# EAGLE design powersupply (EAGLE 7.5.0)
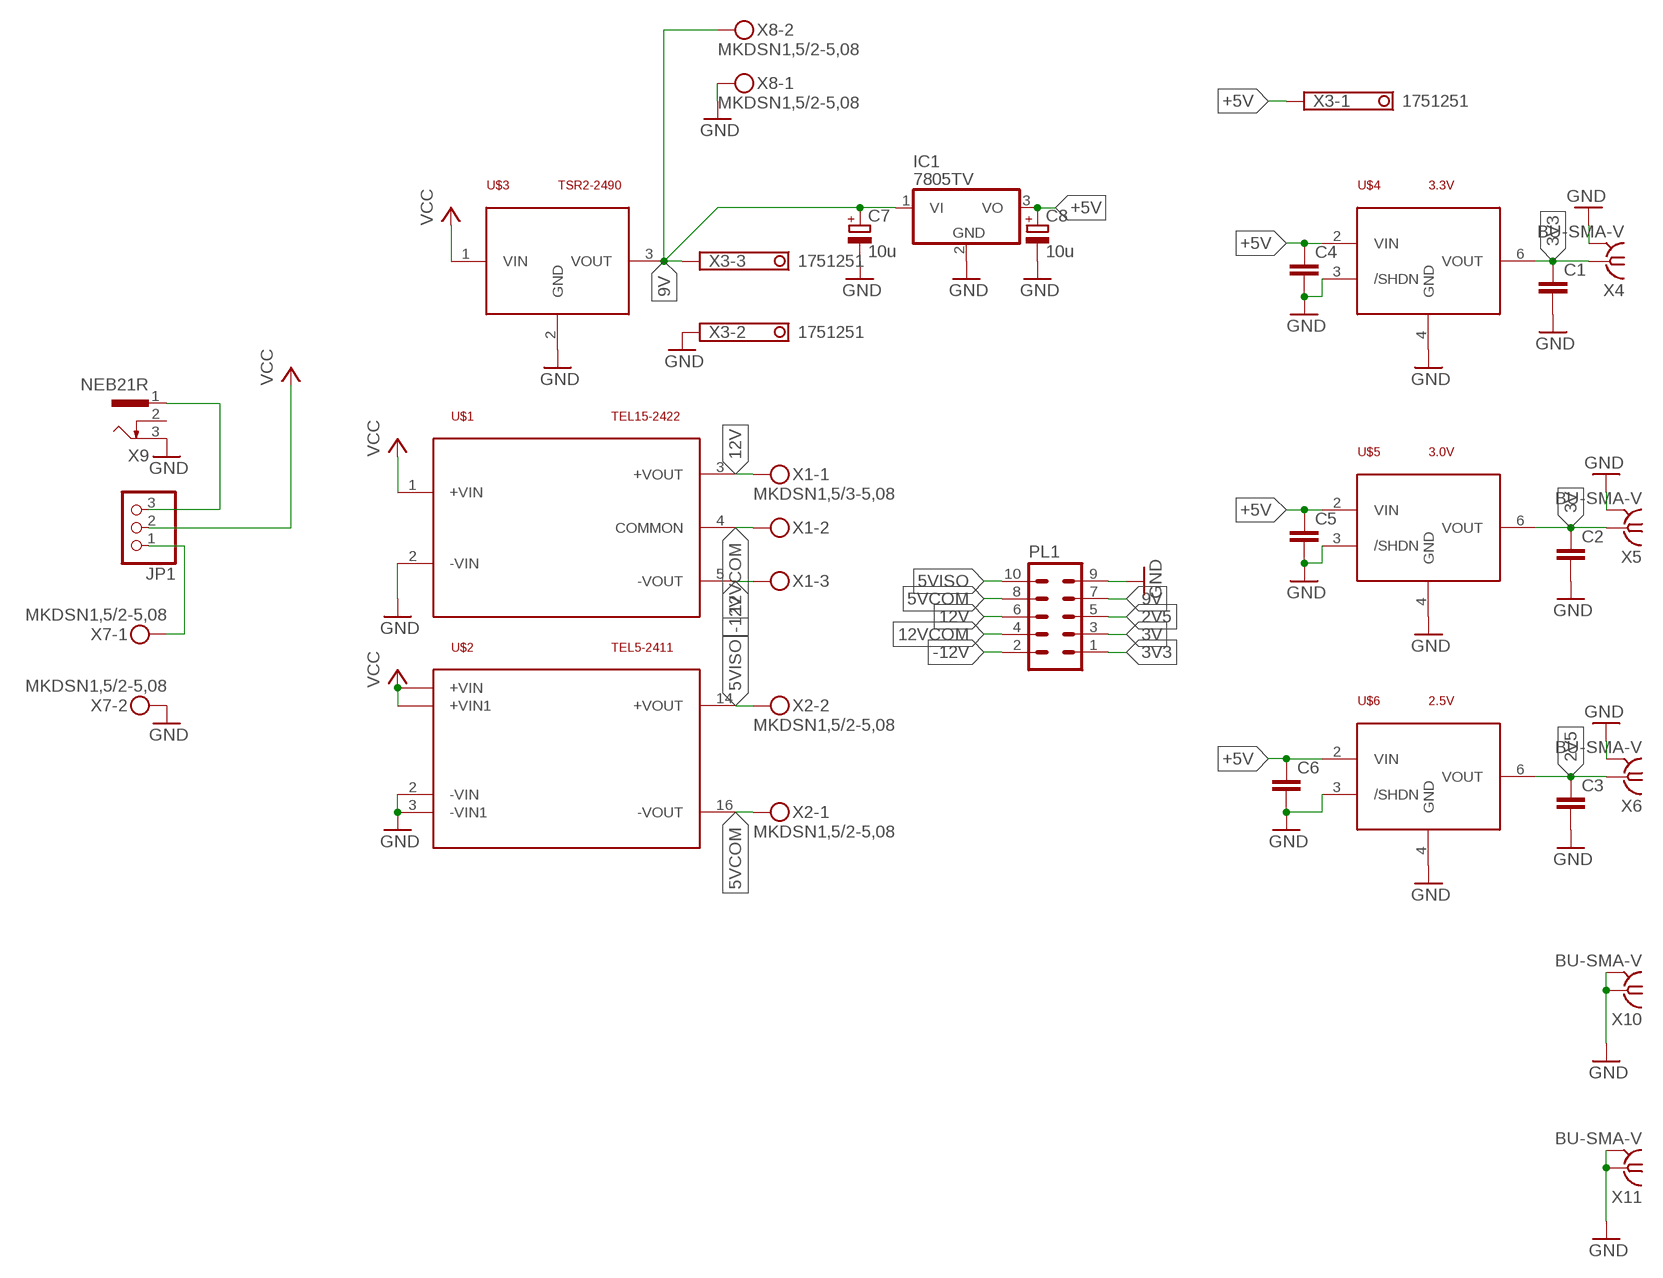
[diagram p0: schematic, sheet 1]

## Parts
C1  C-EUC0805  [C0805]
C2  C-EUC0805  [C0805]
C3  C-EUC0805  [C0805]
C4  C-EUC0805  [C0805]
C5  C-EUC0805  [C0805]
C6  C-EUC0805  [C0805]
C7  10u  CPOL-EUB  [PANASONIC_B]
C8  10u  CPOL-EUB  [PANASONIC_B]
IC1  7805TV  [TO220V]
JP1  PINHD-1X3  [1X03]
PL1  10V  [10V]
U$1  TEL15-2422  TEL-15  [TEL-15]
U$2  TEL5-2411  TEL-5-SINGLE  [TEL-5-SINGLE]
U$3  TSR2-2490  TSR2  [TSR2]
U$4  3.3V  LT1461  [SO8]
U$5  3.0V  LT1461  [SO8]
U$6  2.5V  LT1461  [SO8]
X1  MKDSN1,5/3-5,08  [MKDSN1,5/3-5,08]
X2  MKDSN1,5/2-5,08  [MKDSN1,5/2-5,08]
X3  1751251  [1751251]
X4  BU-SMA-V  [BU-SMA-V]
X5  BU-SMA-V  [BU-SMA-V]
X6  BU-SMA-V  [BU-SMA-V]
X7  MKDSN1,5/2-5,08  [MKDSN1,5/2-5,08]
X8  MKDSN1,5/2-5,08  [MKDSN1,5/2-5,08]
X9  NEB21R  [NEB21R]
X10  BU-SMA-V  [BU-SMA-V]
X11  BU-SMA-V  [BU-SMA-V]

## Nets
2V5: C3.1 PL1.5 U$6.6(VOUT) X6.1
3V: C2.1 PL1.3 U$5.6(VOUT) X5.1
3V3: C1.1 PL1.1 U$4.6(VOUT) X4.1
5VCOM: PL1.8 U$2.16(-VOUT) X2.1
5VISO: PL1.10 U$2.14(+VOUT) X2.2
9V: C7.+ IC1.1(VI) PL1.7 U$3.3(VOUT) X3.3 X8.2
12V: PL1.6 U$1.3(+VOUT) X1.1
12VCOM: PL1.4 U$1.4(COMMON) X1.2
+5V: C4.1 C5.1 C6.1 C8.+ IC1.3(VO) U$4.2(VIN) U$5.2(VIN) U$6.2(VIN) X3.1
-12V: PL1.2 U$1.5(-VOUT) X1.3
GND: C1.2 C2.2 C3.2 C4.2 C5.2 C6.2 C7.- C8.- IC1.2(GND) PL1.9 U$1.2(-VIN) U$2.2(-VIN) U$2.3(-VIN1) U$3.2(GND) U$4.3(/SHDN) U$4.4(GND) U$5.3(/SHDN) U$5.4(GND) U$6.3(/SHDN) U$6.4(GND) X3.2 X4.2 X4.3 X4.4 X4.5 X5.2 X5.3 X5.4 X5.5 X6.2 X6.3 X6.4 X6.5 X7.2 X8.1 X9.3 X10.1 X10.2 X10.3 X10.4 X10.5 X11.1 X11.2 X11.3 X11.4 X11.5
N$11: JP1.1 X7.1
N$12: JP1.3 X9.1
VCC: JP1.2 U$1.1(+VIN) U$2.22(+VIN) U$2.23(+VIN1) U$3.1(VIN)
Unconnected: X9.2

## Library data of the parts
C1-C6 = rcl:C-EU: CAPACITOR, European symbol
C7 C8 = rcl:CPOL-EU: POLARIZED CAPACITOR, European symbol
IC1 = linear:78*: Positive VOLTAGE REGULATOR Source: http://cache.national.com/ds/LM/LM78L05.pdf http://www.fairchildsemi.com/ds/LM/LM7805.pdf
JP1 = pinhead:PINHD-1X3: PIN HEADER
PL1 = con-harting-v:10V: CONNECTOR; OC_FARNELL: unknown; OC_NEWARK: unknown
U$1 = traco:TEL-15
U$2 = traco:TEL-5-SINGLE
U$3 = traco:TSR2
U$4-U$6 = traco:LT1461
X1 = con-phoenix-508:MKDSN1,5/3-5,08: MKDSN 1,5/ 3-5,08 Printklemme Nennstrom: 13,5 A Nennspannung: 250 V Rastermaß: 5,08 mm Polzahl: 3 Anschlussart: Schraubanschluss Montage: Löten Anschlussrichtung Leiter/Platine: 0 ° Artikelnummer: 1729131 Source: http://eshop.phoenixcontact.com .. 1729131.pdf
X2 X7 X8 = con-phoenix-508:MKDSN1,5/2-5,08: MKDSN 1,5/ 2-5,08 Printklemme Nennstrom: 13,5 A Nennspannung: 250 V Rastermaß: 5,08 mm Polzahl: 2 Anschlussart: Schraubanschluss Montage: Löten Anschlussrichtung Leiter/Platine: 0 ° Artikelnummer: 1729128 Source: http://eshop.phoenixcontact.com .. 1729128.pdf
X3 = con-phoenix-350:1751251: MKDS 1/ 3-3,5 Printklemme Nennstrom: 10 A Bemessungsspannung: 160 V Raster: 3,5 mm Polzahl: 3 Montageart: Löten Anschlussart: Schraubanschluss Anschlussrichtung vom Leiter zur Platine: 0° Source: http://eshop.phoenixcontact.com .. 1751251.pdf; OC_FARNELL: unknown; OC_NEWARK: unknown
X4-X6 X10 X11 = con-coax:BU-SMA-V: FEMALE SMA CONNECTOR Radiall distributor RS 112-3794; OC_FARNELL: unknown; OC_NEWARK: unknown
X9 = con-lumberg:NEB21R: Netzgeräte-Einbaukupplung abgewinkelte Ausführung mit Öffner Source: http://www.lumberg.com/Produkte/PDFs/NEB21R.pdf; MPN: NEB 21 R; OC_FARNELL: 1217037; OC_NEWARK: 97K6458

## Board
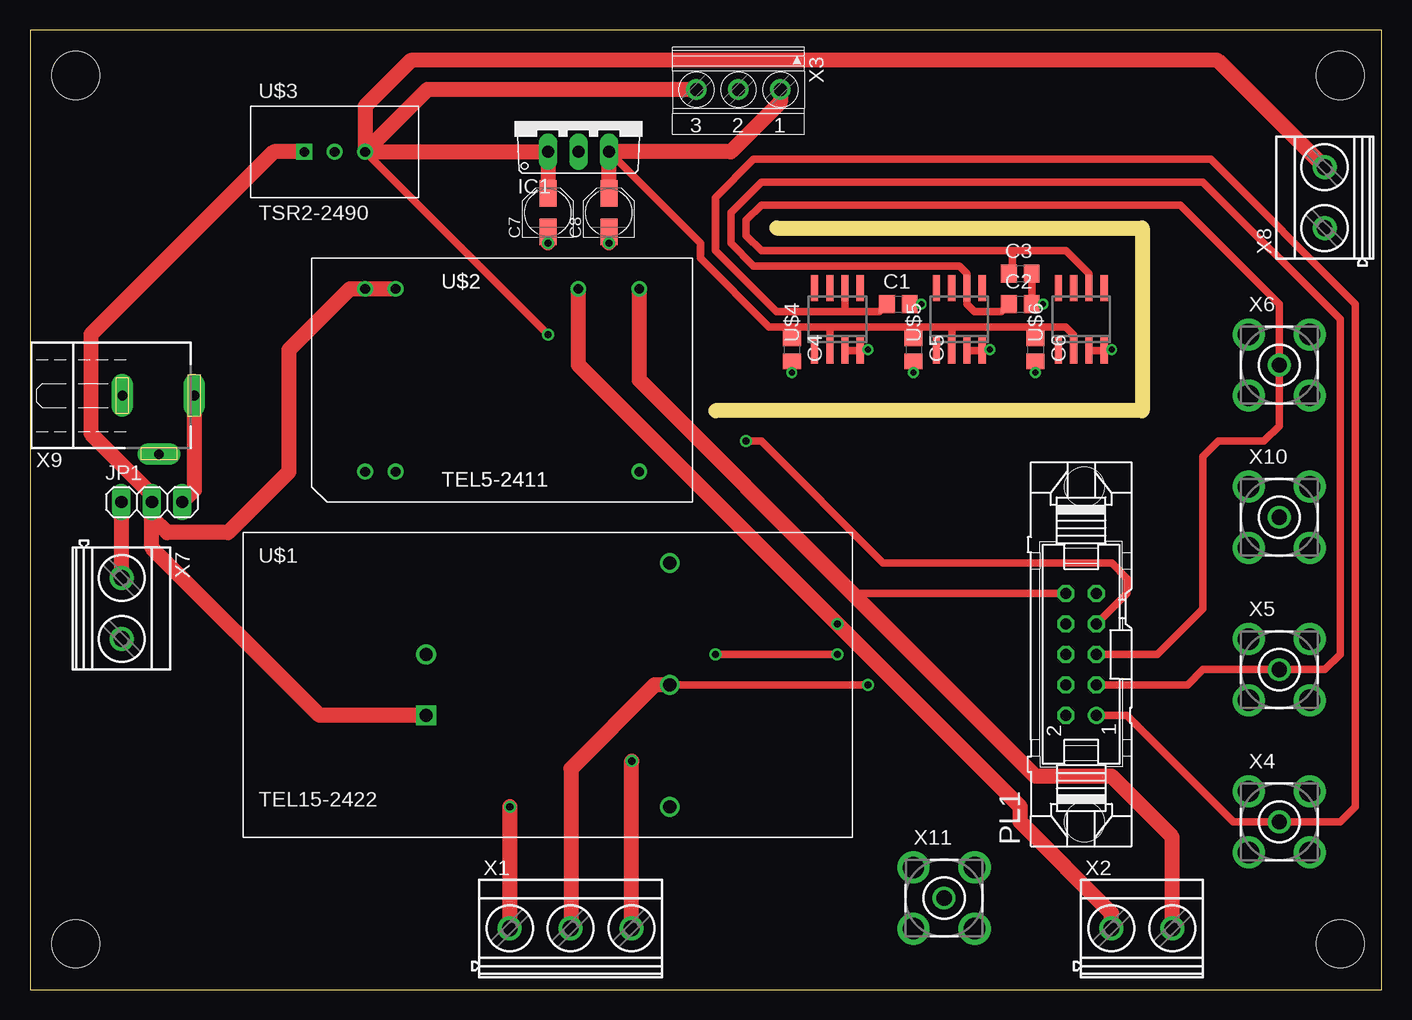
[diagram p1: board, top side]
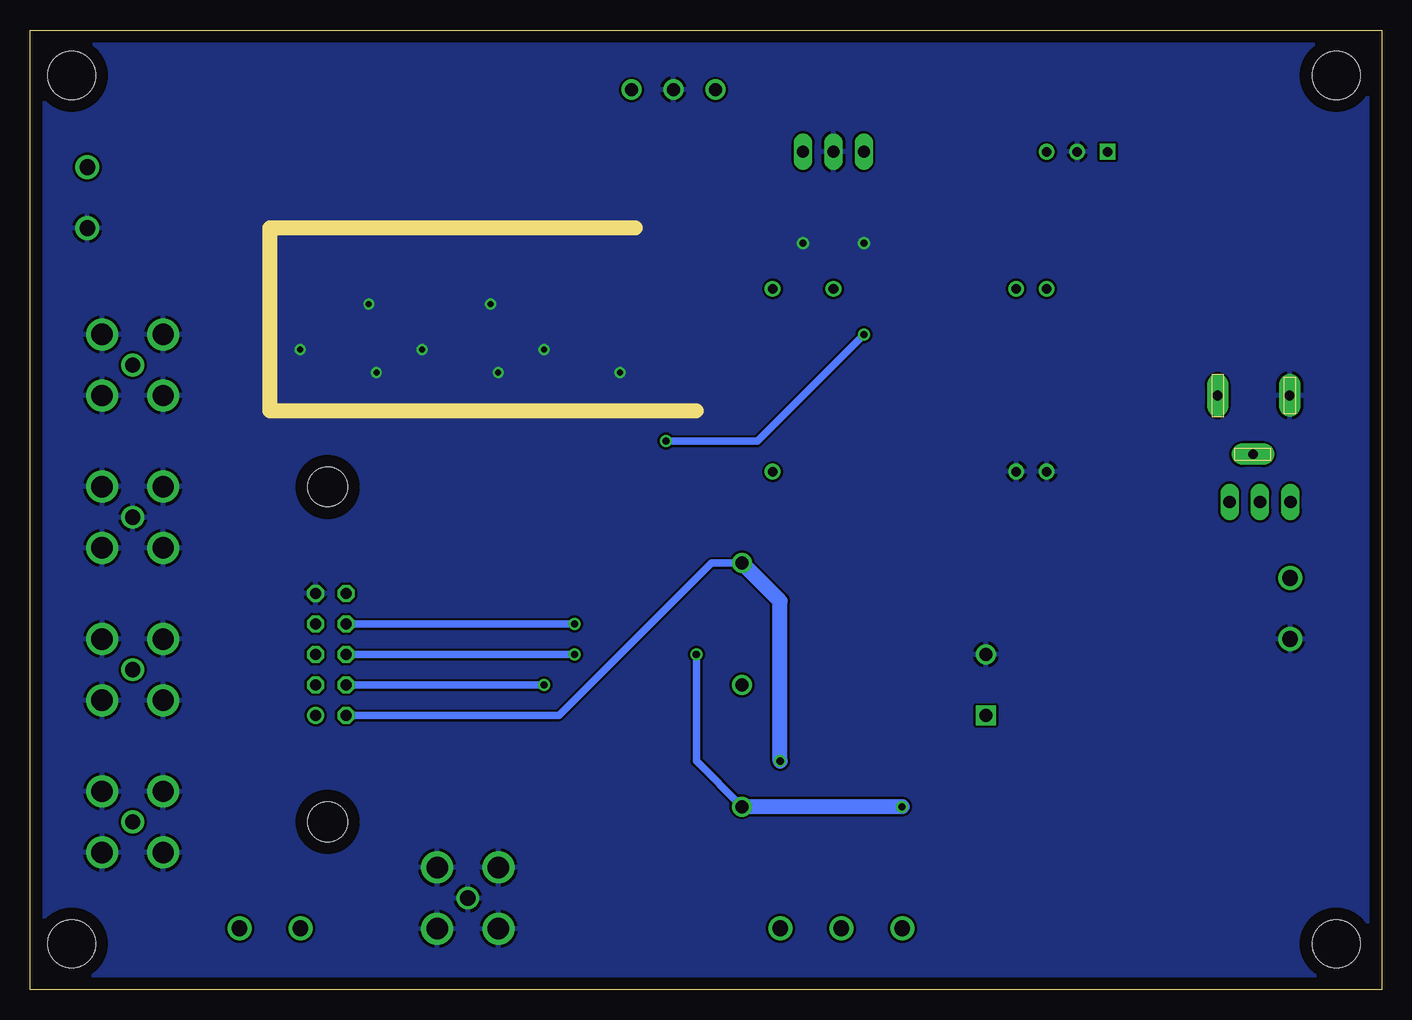
[diagram p2: board, bottom side, seen from below]

Size 112.7 x 80 mm. Coordinates in mm from the lower left corner, seen from the top.
Outline: 0,0 112.7,0 112.7,80 0,80 0,0
Copper layers (1*16): Top 0.035mm / dielectric 1.5mm / Bottom 0.035mm
Design rules "default": minimum track width 10mil, minimum drill 24mil, track to track 8mil, track to pad 8mil, pad to pad 8mil, via to via 8mil, smd to smd 8mil, copper to edge 40mil, drill to drill 8mil, minimum pad ring 10mil, minimum via ring 8mil, stop-mask expansion 4mil, vias tented up to drill 0mil, thermal gap 10mil
Holes 4 mm at 3.81,76.2 3.81,3.81 109.22,3.81 109.22,76.2
Milling: 3 lines

### Footprints (pad centres in the part's own frame; a part is rotated, then mirrored left to right if it is on the bottom)
C0805 = smd 1.3 x 1.5: 1 -0.95,0; 2 0.95,0
PANASONIC_B = smd 2.2 x 1.4: + 1.6,0; - -1.6,0
TO220V = drill 1.016 long: 1 -2.54,-2.54; 2 0,-2.54; 3 2.54,-2.54
1X03 = drill 1.016 long: 1 -2.54,0; 2 0,0; 3 2.54,0
10V = drill 0.914: 1 -5.08,-1.27 | drill 0.914 octagon: 2 -5.08,1.27; 3 -2.54,-1.27; 4 -2.54,1.27; 5 0,-1.27; 6 0,1.27; 7 2.54,-1.27; 8 2.54,1.27; 9 5.08,-1.27; 10 5.08,1.27 | hole 3.302: 13.97,-0.254; -13.97,-0.254
TEL-15 = drill 1.1 square: 1 15.24,10.16 | drill 1.1: 2 15.24,15.24; 3 35.56,2.54; 4 35.56,12.7; 5 35.56,22.86
TEL-5-SINGLE = drill 0.8: 2 5.08,2.54; 3 7.62,2.54; 11 27.94,2.54; 14 27.94,17.78; 16 22.86,17.78; 22 7.62,17.78; 23 5.08,17.78
TSR2 = drill 0.8 square: 1 -2.54,0 | drill 0.8: 2 0,0; 3 2.54,0
SO8 = smd 0.6 x 2.2: 1 -1.905,-2.6; 2 -0.635,-2.6; 3 0.635,-2.6; 4 1.905,-2.6; 5 1.905,2.6; 6 0.635,2.6; 7 -0.635,2.6; 8 -1.905,2.6
MKDSN1,5/3-5,08 = drill 1.3 pad 2: 1 -7.641,0.025; 2 -2.561,0.025; 3 2.519,0.025
MKDSN1,5/2-5,08 = drill 1.3 pad 2: 1 -2.561,0.025; 2 2.519,0.025
1751251 = drill 1.1 pad 1.7: 1 -3.5,-0.1; 2 0,-0.1; 3 3.5,-0.1
BU-SMA-V = drill 1.27: 1 0,0 | drill 1.778: 2 -2.55,2.55; 3 2.55,2.55; 4 2.55,-2.55; 5 -2.55,-2.55
NEB21R = drill 0.813 pad 1.778 long: 1 0,7.35; 2 4.9,4.4; 3 0,1.35

### Placement (x,y rotation side)
C1  72.39,57.15 0 top
C2  82.55,57.15 0 top
C3  82.55,59.69 0 top
C4  63.5,53.34 270 top
C5  73.66,53.34 270 top
C6  83.82,53.34 270 top
C7  43.18,64.77 90 top
C8  48.26,64.77 90 top
IC1  45.72,72.39 0 top
JP1  10.16,40.64 0 top
PL1  87.63,27.94 90 top
U$1  17.78,12.7 0 top
U$2  22.86,40.64 0 top
U$3  25.4,69.85 0 top
U$4  67.31,55.88 0 top
U$5  77.47,55.88 0 top
U$6  87.63,55.88 0 top
X1  47.62,5.08 0 top
X2  92.71,5.08 0 top
X3  59.05,74.93 180 top
X4  104.14,13.97 0 top
X5  104.14,26.67 0 top
X6  104.14,52.07 0 top
X7  7.62,31.75 270 top
X8  107.95,66.04 90 top
X9  6.35,49.53 270 top
X10  104.14,39.37 0 top
X11  76.2,7.62 0 top

### Tracks (layer width: path | path; a pad name or v marks a point on that pad's centre or on a via)
2V5
  Top 0.61: U$6.6 88.27,59.69 86.36,61.59 81.91,61.59 | 81.91,61.59 60.96,61.59 59.69,62.87 59.69,64.14 60.96,65.41 95.88,65.41 104.14,57.15 X6.1 104.14,46.99 102.87,45.72 99.06,45.72 97.79,44.45 97.79,31.75 93.98,27.94 PL1.5 | 81.91,61.59 81.91,60.01 C3.1
3V
  Top 0.61: C2.1 80.96,56.52 78.74,56.52 78.1,57.15 U$5.6 78.1,59.69 77.47,60.33 60.33,60.33 58.42,62.23 58.42,64.77 60.96,67.31 97.79,67.31 109.22,55.88 109.22,27.94 107.95,26.67 X5.1 97.79,26.67 96.52,25.4 PL1.3
3V3
  Top 0.61: U$4.6 67.94,56.52 | 67.94,56.52 62.23,56.52 57.15,61.59 57.15,66.04 60.33,69.22 98.42,69.22 110.49,57.15 110.49,15.24 109.22,13.97 X4.1 100.33,13.97 91.44,22.86 PL1.1 | 67.94,56.52 70.8,56.52 C1.1
5VCOM  (via drill 0.6)
  Top 1.27: X2.1 90.15,6.37 82.55,13.97 82.55,15.24 v67.31,30.48 45.72,52.07 U$2.16
  Bottom 0.61: PL1.8 v67.31,30.48
5VISO
  Top 0.61: PL1.10 68.58,33.02
  Top 1.27: X2.2 95.23,12.72 90.17,17.78 83.82,17.78 68.58,33.02 50.8,50.8 U$2.14
9V  (via drill 0.6)
  Top 0.61: PL1.7 91.44,33.02 91.44,34.29 90.17,35.56 71.12,35.56 60.96,45.72 v59.69,45.72 | v43.18,54.61 U$3.3
  Top 1.27: U$3.3 IC1.1 C7.+ | X3.3 33.12,75.03 U$3.3 | U$3.3 27.94,73.66 31.75,77.47 99.01,77.47 X8.2
  Bottom 0.61: v59.69,45.72 52.07,45.72 v43.18,54.61
12V  (via drill 0.6)
  Top 0.61: v67.31,27.94 v57.15,27.94
  Top 1.27: X1.1 40.01,5.13 v40.01,15.24
  Bottom 0.61: PL1.6 v67.31,27.94 | v57.15,27.94 57.15,19.05 U$1.3
  Bottom 1.27: v40.01,15.24 U$1.3
12VCOM  (via drill 0.6)
  Top 0.61: v69.85,25.4 U$1.4
  Top 1.27: U$1.4 52.07,25.4 45.09,18.41 45.09,5.13 X1.2
  Bottom 0.61: PL1.4 v69.85,25.4
+5V
  Top 0.61: 62.87,55.24 66.67,55.24 | 66.67,55.24 74.29,55.24 | 76.83,55.24 84.45,55.24 | U$6.2 86.99,54.61 86.36,55.24 84.45,55.24 | U$5.2 76.83,55.24 | U$4.2 66.67,55.24 | 84.45,55.24 83.82,54.61 C6.1 | 76.83,55.24 74.29,55.24 | 74.29,55.24 73.66,54.61 C5.1 | 62.87,55.24 61.59,55.24 55.88,60.96 55.88,62.23 IC1.3 | 62.87,55.24 63.5,54.61 C4.1 | 48.59,66.04 C8.+
  Top 1.27: C8.+ IC1.3 58.42,69.85 62.55,73.98 X3.1
-12V  (via drill 0.6)
  Top 1.27: 50.16,5.08 | 50.16,5.08 X1.3 | 50.16,5.08 v50.16,19.05
  Bottom 0.61: PL1.2 68.58,22.86 55.88,35.56 U$1.5
  Bottom 1.27: v50.16,19.05 50.16,32.38 U$1.5
GND  (via drill 0.5, 0.6)
  Top 0.61: v69.85,53.34 69.79,53.28 U$4.4 U$4.3 | v80.01,53.34 79.95,53.28 U$5.4 U$5.3 | v90.17,53.34 90.11,53.28 U$6.4 U$6.3 | C3.2 C2.2 v84.45,57.15 | C4.2 v63.5,51.44 | C5.2 v73.66,51.44 | C1.2 v74.29,57.15 | C6.2 v83.82,51.44
  Top 1.27: C7.- v43.18,62.23 | C8.- v48.26,62.23
  pour Bottom: 0,0 0,80.01 113.03,80.01 113.03,0
N$11
  Top 1.27: X7.1 7.64,40.62 JP1.1
N$12
  Top 1.27: X9.1 13.7,41.64 JP1.3
VCC
  Top 1.27: U$1.1 24.13,22.86 10.16,36.83 10.16,39.37 | 10.16,39.37 JP1.2 10.16,41.27 5.08,46.35 5.08,54.61 20.32,69.85 U$3.1 | 10.16,39.37 11.43,38.1 16.51,38.1 21.59,43.18 21.59,53.34 26.67,58.42 U$2.23 U$2.22